# EAGLE design wAveC (EAGLE 6.5.0)
AUTHOR: Brad Campbell; REV: A; TITLE: wAveC
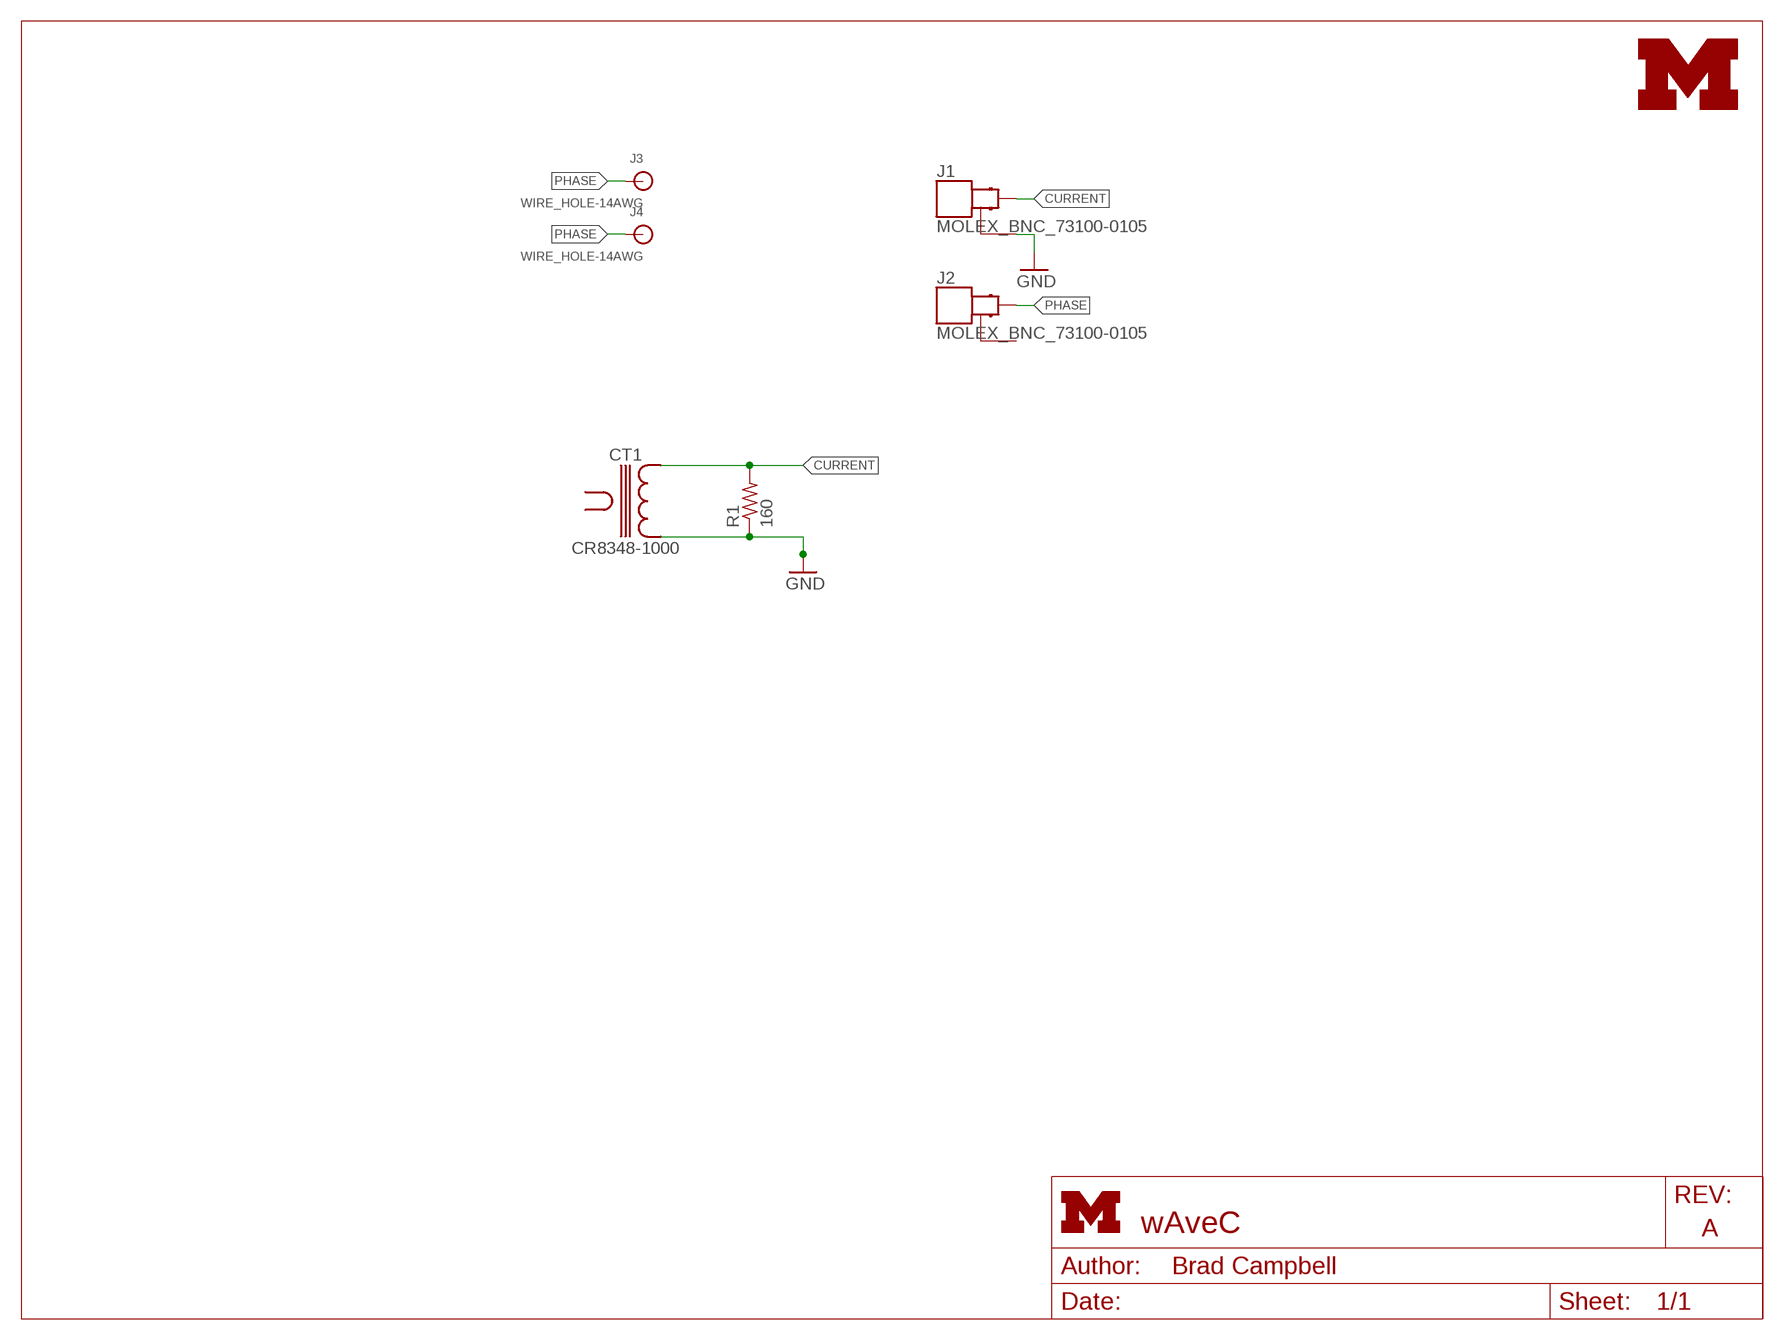
[diagram p0: schematic, sheet 1]
FRAME1 (LETTER_L): HEIGHT: 8.5in; WIDTH: 11in

## Parts
CT1  CR8348-1000  [CR8348]
J1  MOLEX_BNC_73100-0105  [MOLEX-BNC-73100-0105]
J2  MOLEX_BNC_73100-0105  [MOLEX-BNC-73100-0105]
J3  WIRE_HOLE-14AWG  [WIRE_HOLE-14AWG]
J4  WIRE_HOLE-14AWG  [WIRE_HOLE-14AWG]
LOGO1  UMICH_SOLID_MEDIUM  [UMICH_SOLID_200MIL]
R1  160  R-US_R1210  [R1210]

## Nets
CURRENT: CT1.1 J1.SIGNAL R1.2
GND: CT1.2 J1.GND1(GND) J1.GND2(GND) R1.1
PHASE: J2.SIGNAL J3.P$1 J4.P$1
Unconnected: J2.GND1(GND) J2.GND2(GND)

## Library data of the parts
CT1 = ac:CR8348: Current Transformer General Purpose; DIGIKEY: 582-1161-ND
J1 J2 = connector:MOLEX_BNC_73100-0105: CONN BNC JACK R/A 50 OHM PCB; DIGIKEY: WM5524-ND
J3 J4 = ac:WIRE_HOLE-14AWG: Solder point for 14AWG wire
LOGO1 = logos:UMICH_SOLID
R1 = rcl:R-US_: RESISTOR, American symbol; DIGIKEY: P160QCT-ND

## Board
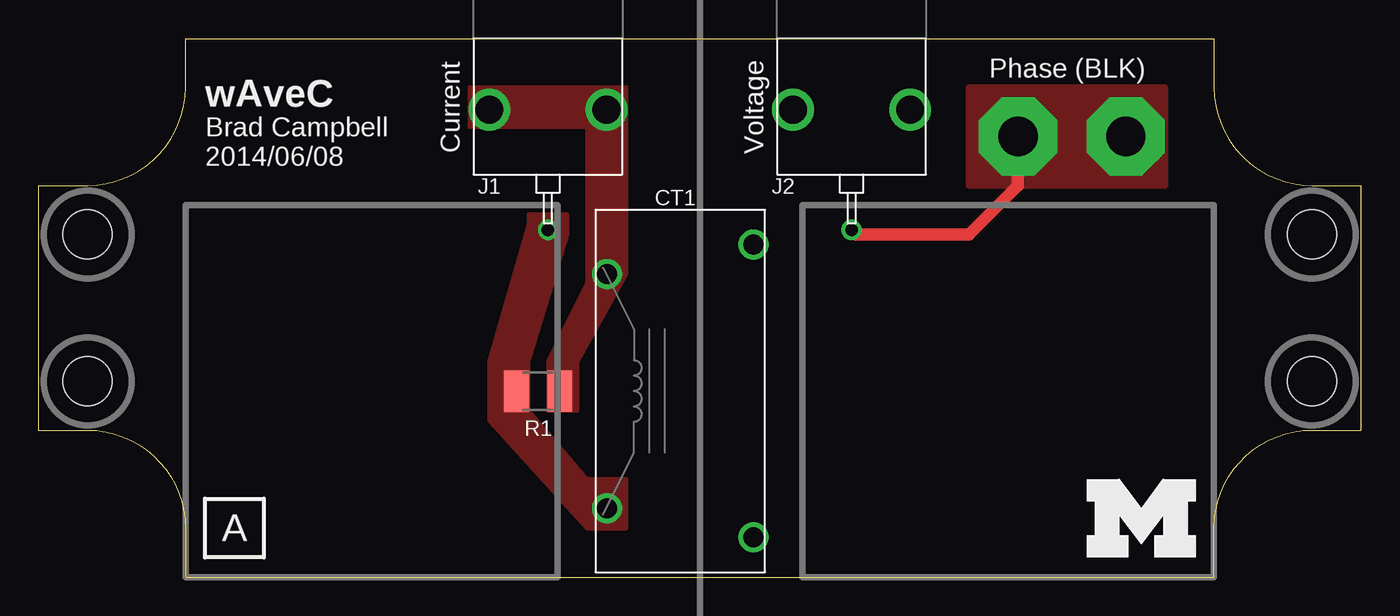
[diagram p1: board, top side]
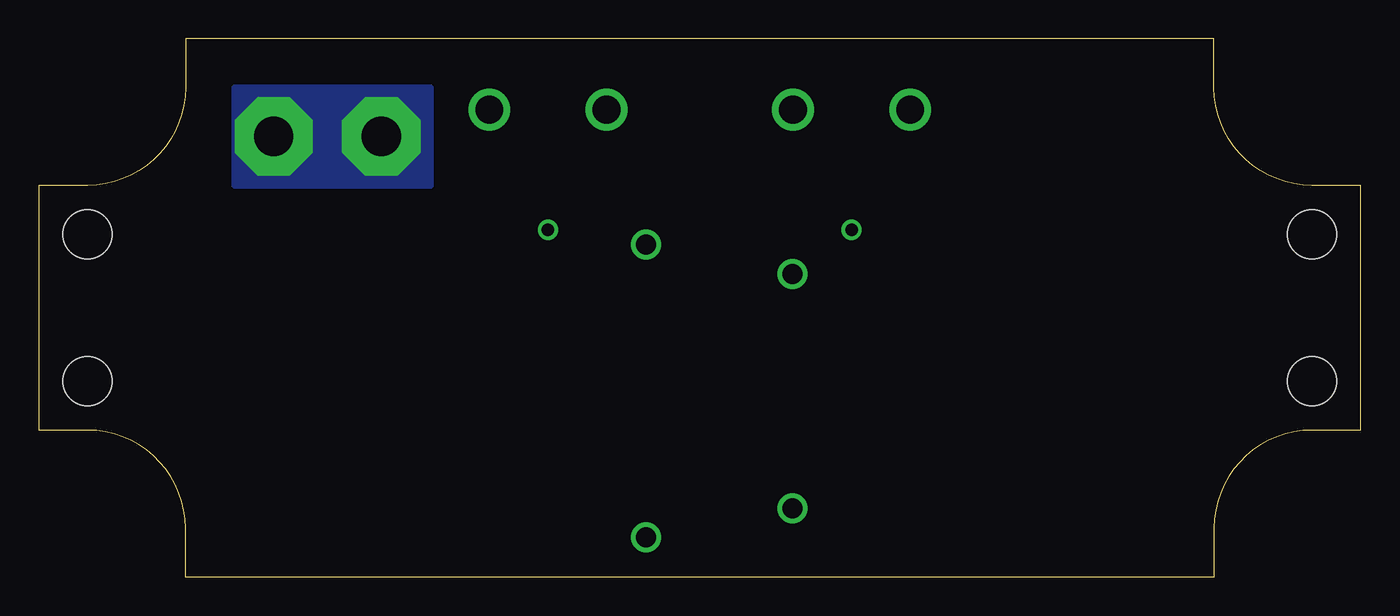
[diagram p2: board, bottom side, seen from below]

Size 85.72 x 34.92 mm. Coordinates in mm from the lower left corner, seen from the top.
Outline: 9.53,0 76.2,0 76.2,3.17 arc-90 82.55,9.53 85.72,9.53 85.72,25.4 82.55,25.4 arc-90 76.2,31.75 76.2,34.92 9.53,34.92 9.53,31.75 arc-90 3.17,25.4 0,25.4 0,9.53 3.17,9.53 arc-90 9.53,3.17 9.53,0
Copper layers (1*16): Top 0.035mm / dielectric 1.5mm / Bottom 0.035mm
Design rules "default": minimum track width 10mil, minimum drill 24mil, track to track 8mil, track to pad 8mil, pad to pad 8mil, via to via 8mil, smd to smd 8mil, copper to edge 40mil, drill to drill 8mil, minimum pad ring 10mil, minimum via ring 8mil, stop-mask expansion 4mil, vias tented up to drill 0mil, thermal gap 10mil
Holes 3.17 mm at 3.17,12.7 3.17,22.23 82.55,12.7 82.55,22.23

### Footprints (pad centres in the part's own frame; a part is rotated, then mirrored left to right if it is on the bottom)
CR8348 = drill 1.3: 1 -7.6,4.75; 2 7.6,4.75; P$3 -9.5,-4.75; P$4 9.5,-4.75
MOLEX-BNC-73100-0105 = drill 1.8: GND1 -3.8,-3.9; GND2 3.8,-3.9 | drill 0.8: SIGNAL 0,3.9
WIRE_HOLE-14AWG = drill 2.54 pad 5.08 octagon: P$1 0,0
R1210 = smd 1.6 x 2.7: 1 -1.4,0; 2 1.4,0

### Placement (x,y rotation side)
CT1  41.59,12.06 90 top
J1  33.02,26.42 180 top
J2  52.7,26.42 180 top
J3  63.5,28.57 0 top
J4  70.48,28.57 0 top
LOGO1  67.94,1.27 0 top
R1  32.38,12.06 180 top

### Tracks (layer width: path | path; a pad name or v marks a point on that pad's centre or on a via)
CURRENT
  pour Top (no thermals): 31.75,22.86 29.21,13.97 29.21,10.16 35.56,3.17 38.1,3.17 38.1,6.35 35.56,6.35 31.75,10.79 31.75,13.97 34.29,22.23 34.29,23.5 31.75,23.5
GND
  pour Top (no thermals): 27.94,31.75 27.94,29.21 35.56,29.21 35.56,19.05 33.02,13.97 33.02,10.79 34.92,10.79 34.92,13.97 38.1,19.68 38.1,31.75
PHASE
  Top 0.813: J3.P$1 63.5,25.4 60.33,22.23 53,22.23 J2.SIGNAL
  pour Top (no thermals): 60.33,31.75 60.33,25.4 73.03,25.4 73.03,31.75
  pour Bottom (no thermals): 60.33,31.75 60.33,25.4 73.03,25.4 73.03,31.75

### Text on the board
tPlace: Phase (BLK) | wAveC | Current | Voltage | Brad Campbell | 2014/06/08 | A